# EAGLE design M_G_ext_step_motor (EAGLE 9.6.2)
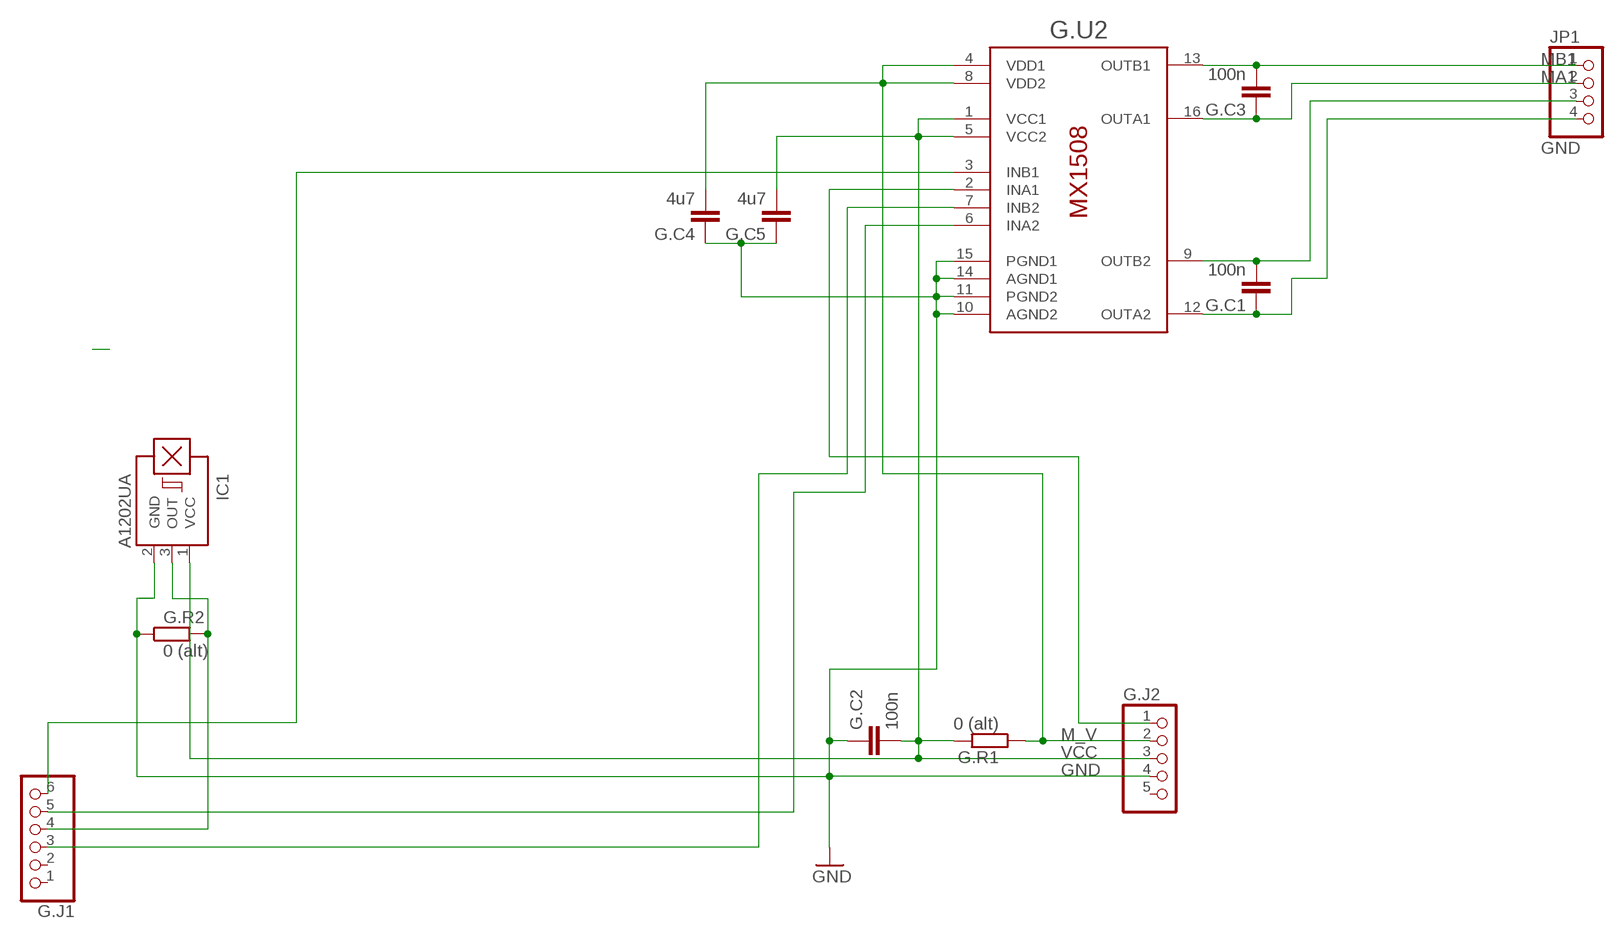
[diagram p0: schematic, sheet 1]

## Parts
G.C1  100n  C-EUC0603  [C0603]
G.C2  100n  C-EUC0603  [C0603]
G.C3  100n  C-EUC0603  [C0603]
G.C4  4u7  C-EUC0603  [C0603]
G.C5  4u7  C-EUC0603  [C0603]
G.J1  PINHD-1X6  [1X06]
G.J2  PINHD-1X5  [1X05]
G.R1  0 (alt)  R-EU_R0603  [R0603]
G.R2  0 (alt)  R-EU_R0603  [R0603]
G.U2  MX1508  [SOP16]
IC1  A1202UA  [SIP3-UA]
JP1  PINHD-1X4  [1X04]

## Nets
GND: G.C2.1 G.C4.1 G.C5.1 G.J2.4 G.R2.1 G.U2.10(AGND2) G.U2.11(PGND2) G.U2.14(AGND1) G.U2.15(PGND1) IC1.2(GND)
INA1: G.J2.1 G.U2.2(INA1)
INA2: G.J1.5 G.U2.6(INA2)
INB1: G.J1.6 G.U2.3(INB1)
INB2: G.J1.3 G.U2.7(INB2)
M_V: G.C4.2 G.J2.2 G.R1.1 G.U2.4(VDD1) G.U2.8(VDD2)
MA1: G.C3.1 G.U2.16(OUTA1) JP1.2
MA2: G.C1.1 G.U2.12(OUTA2) JP1.4
MB1: G.C3.2 G.U2.13(OUTB1) JP1.1
MB2: G.C1.2 G.U2.9(OUTB2) JP1.3
N$3: G.J1.4 G.R2.2 IC1.3(OUT)
VCC: G.C2.2 G.C5.2 G.J2.3 G.R1.2 G.U2.1(VCC1) G.U2.5(VCC2) IC1.1(VCC)
Unconnected: G.J1.1 G.J1.2 G.J2.5

## Library data of the parts
G.C1-G.C5 = rcl:C-EU: CAPACITOR, European symbol; SPICEPREFIX: C
G.J1 = pinhead2:PINHD-1X6: PIN HEADER
G.J2 = pinhead2:PINHD-1X5: PIN HEADER
G.R1 G.R2 = rcl:R-EU_: RESISTOR, European symbol; SPICEPREFIX: R
G.U2 = hugo:MX1508
IC1 = allegro2:A12*?: Hall-effect bipolar switch Source: http://www.allegromicro.com/en/Products/Part_Numbers/1202/1202.pdf; OC_FARNELL: unknown; OC_NEWARK: unknown
JP1 = pinhead2:PINHD-1X4: PIN HEADER

## Board
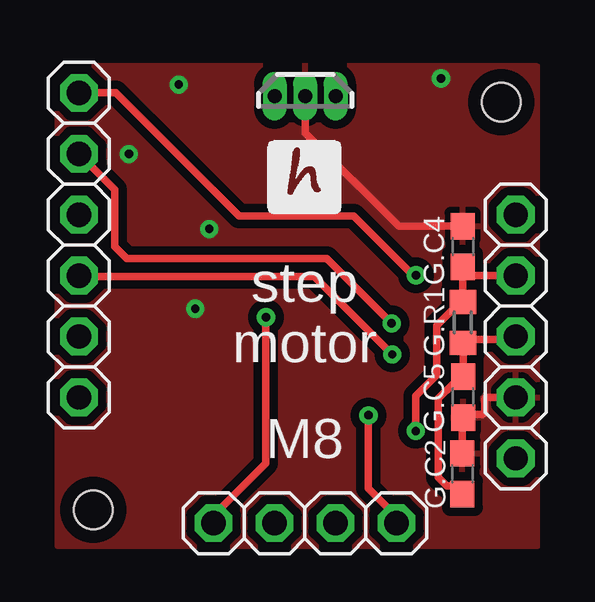
[diagram p1: board, top side]
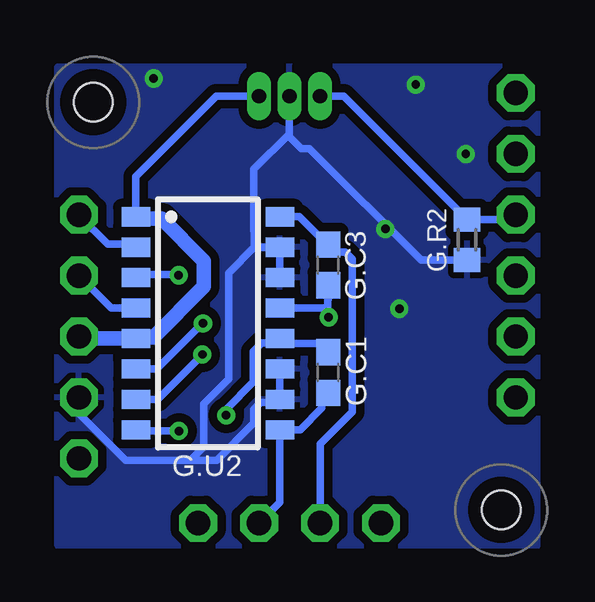
[diagram p2: board, bottom side, seen from below]

No outline drawn. Coordinates in mm, seen from the top.
Copper layers (1*16): Top 0.035mm / dielectric 1.5mm / Bottom 0.035mm
Design rules "default *": minimum track width 10mil, minimum drill 0.35mm, track to track 14mil, track to pad 13mil, pad to pad 10mil, via to via 14mil, smd to smd 14mil, copper to edge 15mil, drill to drill 15mil, minimum pad ring 8mil, minimum via ring 8mil, stop-mask expansion 4mil, vias tented up to drill 0mil, thermal gap 10mil
Holes 1.6 mm at 2,2 19,19
tRestrict: area 18,18 to 20,20; area 1,1 to 3,3
bRestrict: area 1,1 to 3,3; area 18,18 to 20,20

### Footprints (pad centres in the part's own frame; a part is rotated, then mirrored left to right if it is on the bottom)
C0603 = smd 1.1 x 1: 1 -0.85,0; 2 0.85,0
1X06 = drill 1.016 pad 1.575 octagon: 1 -6.35,0; 2 -3.81,0; 3 -1.27,0; 4 1.27,0; 5 3.81,0; 6 6.35,0
1X05 = drill 1.016 pad 1.575 octagon: 1 -5.08,0; 2 -2.54,0; 3 0,0; 4 2.54,0; 5 5.08,0
R0603 = smd 1 x 1.1: 1 -0.85,0; 2 0.85,0
SOP16 = smd 0.8 x 1.2: 1 -4.445,-3; 2 -3.175,-3; 3 -1.905,-3; 4 -0.635,-3; 5 0.635,-3; 6 1.905,-3; 7 3.175,-3; 8 4.445,-3; 9 4.445,3; 10 3.175,3; 11 1.905,3; 12 0.635,3; 13 -0.635,3; 14 -1.905,3; 15 -3.175,3; 16 -4.445,3
SIP3-UA = drill 0.6 pad 0.889 long: 1 -1.27,0; 2 0,0; 3 1.27,0
1X04 = drill 1.016 pad 1.575 octagon: 1 -3.81,0; 2 -1.27,0; 3 1.27,0; 4 3.81,0

### Placement (x,y rotation side)
G.C1  9.22,7.73 270 bottom
G.C2  17.37,3.51 270 top
G.C3  9.22,12.21 270 bottom
G.C4  17.39,12.98 270 top
G.C5  17.41,6.7 90 top
G.J1  1.4,13.04 90 top
G.J2  19.6,9.23 270 top
G.R1  17.4,9.82 270 top
G.R2  3.43,13.26 90 bottom
G.U2  14.22,9.78 270 bottom
IC1  10.83,19.25 180 top
JP1  10.82,1.45 0 top

### Tracks (layer width: path | path; a pad name or v marks a point on that pad's centre or on a via)
GND  (via drill 0.35)
  Top 0.305: 18.94,6.69 G.J2.4 18.37,6.69 18.31,6.63 18.31,6.06 18.23,5.98 17.41,5.98 G.C5.1 17.37,5.82 G.C2.1 | G.C4.1 14.72,13.83 10.83,17.72 IC1.2
  Bottom 0.305: G.J2.4 19.6,6.03 17.64,4.07 14.96,4.07 | G.U2.11 G.U2.10 11.35,6.48 12.02,6.48 12.31,6.19 12.31,5.63 13.86,4.07 14.96,4.07 | G.U2.15 12.29,12.95 | 12.29,12.95 13.36,11.88 13.36,7.47 14.4,6.43 14.4,4.63 14.96,4.07 | G.U2.14 G.U2.15 | G.U2.15 11.24,12.94 12.2,12.94 | G.R2.1 5.34,12.41 10,17.07 10.34,17.07 10.83,17.56 10.83,17.68 | 10.83,17.68 IC1.2 | 12.29,12.95 12.29,13.61 12.31,13.62 12.31,16.2 10.83,17.68
  other vias: 5.56,19.74 3.48,16.84 6.25,10.39 6.83,13.72 16.48,19.99
  pour Top (isolate 0.254): 0.5,20.5 0.5,0.5 20.5,0.5 20.5,20.5
  pour Bottom (isolate 0.254): 0.5,20.5 0.5,0.5 20.5,0.5 20.5,20.5
INA1
  Bottom 0.305: G.U2.2 17.36,13.09 18.41,13.09 19.6,14.28 G.J2.1
INA2  (via drill 0.35)
  Top 0.305: v14.43,9.78 11.73,12.48 3.39,12.48 2.9,12.98 2.9,15.35 G.J1.5
  Bottom 0.305: G.U2.6 16.36,7.87 14.45,9.78 v14.43,9.78
INB1  (via drill 0.35)
  Top 0.305: v15.45,11.79 15.32,11.79 12.86,14.25 8.08,14.25 2.94,19.39 G.J1.6
  Bottom 0.305: G.U2.3 17.1,11.81 15.47,11.81 v15.45,11.79
INB2  (via drill 0.35)
  Top 0.305: G.J1.3 1.44,11.73 11.21,11.73 v14.46,8.48
  Bottom 0.305: G.U2.7 16.31,6.6 14.46,8.46 v14.46,8.48
M_V  (via drill 0.35)
  Top 0.305: G.J2.2 17.75,11.77 G.C4.2 G.R1.1 17.14,10.41 17.03,10.41 16.31,9.69 16.31,7.64 15.43,6.76 v15.43,5.29
  Bottom 0.305: G.U2.4 18.24,10.41 G.J2.2 | G.U2.8 17.18,5.29 v15.43,5.29
MA1
  Bottom 0.305: G.U2.16 10.41,14.22 9.24,13.06 G.C3.1 8.92,12.76 8.51,12.76 8.2,12.46 8.2,6.1 9.55,4.75 JP1.2
MA2  (via drill 0.35)
  Top 0.305: v13.46,5.94 13.46,2.9 14.63,1.73 JP1.4
  Bottom 0.305: G.C1.1 9.56,8.94 11.02,8.94 G.U2.12 11.41,8.96 11.97,8.96 12.33,8.6 12.33,7.33 13.46,6.2 v13.46,5.94
MB1  (via drill 0.35)
  Top 0.305: v9.2,10.03 9.2,3.94 7.09,1.83 7.09,1.52 JP1.1
  Bottom 0.305: 11.17,10.47 G.U2.13 9.26,10.41 9.22,10.45 G.C3.2 9.22,10.06 v9.2,10.03
MB2
  Bottom 0.305: G.C1.2 9.49,6.61 9.48,6.24 10.38,5.33 G.U2.9 11.22,2.31 JP1.3
N$3
  Bottom 0.305: G.J1.4 1.6,14.11 G.R2.2 8.57,19.25 IC1.3
VCC
  Top 0.305: G.J2.3 19.47,9.1 17.53,9.1 G.R1.2 G.C5.2 17.41,7.24 16.97,7.24 16.38,6.66 16.38,3.36 16.73,3.01 17.37,3.01 G.C2.2
  Bottom 0.305: 17.14,14.14 G.U2.1 17.22,15.9 13.87,19.25 IC1.1 | 17,9.2 17.05,9.14 G.U2.5 17.23,9.15
  Bottom 0.61: 17.14,14.14 16.14,14.14 14.39,12.39 14.39,11.31 16.51,9.2 17,9.2 | 17.23,9.15 19.52,9.15 G.J2.3

### Text on the board
tPlace: step / motor | M8